# Altium schematic sheet 元器件模块原理图.SchDoc
size A4
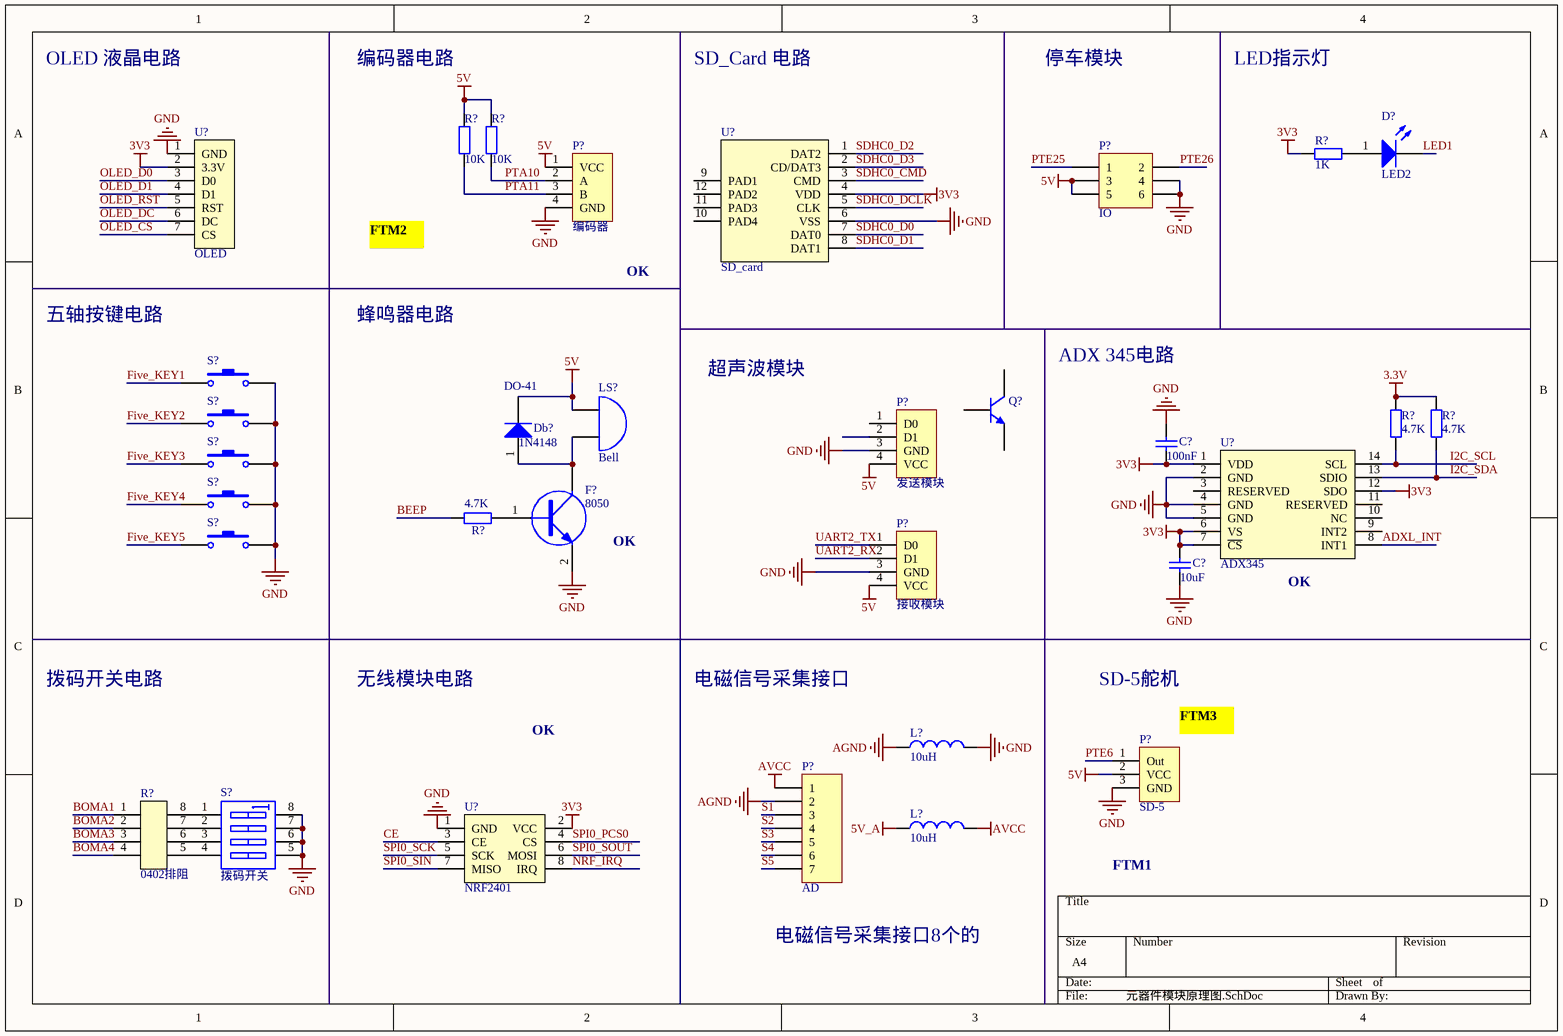
[diagram p0: 元器件模块原理图.SchDoc]

## Parts
(Parts that share a designator on the sheet are numbered #1, #2 ... from top to bottom, then left to right.)
C?#1  value 100nF  [C0603]  (hidden comment: Cap)
C?#2  value 10uF  [C0603]  (hidden comment: Cap)
D?  LED2  [LED-0805 - duplicate]
Db?  1N4148  PackageReference: DO-41  [二极管贴片]
F?  8050  [8050 贴片三极管]
L?#1  value 10uH  [R0603]  (hidden comment: Inductor)
L?#2  value 10uH  [R0603]  (hidden comment: Inductor)
LS?  Bell  [蜂鸣器]
P?#1  编码器  [HDR1X4]
P?#2  IO  [HDR2X3]
P?#3  发送模块  [HDR1X4]
P?#4  接收模块  [HDR1X4]
P?#5  SD-5  [HDR1X3]
P?#6  AD  [HDR1X7]
Q?  2N3904  [TO-92A]  (value not drawn)
R?#1  value 10K  [R0603]  (hidden comment: Res2)
R?#2  value 10K  [R0603]  (hidden comment: Res2)
R?#3  value 1K  [R0603]  (hidden comment: Res2)
R?#4  4.7K  [R0603]
R?#5  4.7K  [R0603]
R?#6  4.7K  [R0603]
R?#7  0402排阻  [0402_2]
S?#1  SW-PB  [KEY]  (value not drawn)
S?#2  SW-PB  [KEY]  (value not drawn)
S?#3  SW-PB  [KEY]  (value not drawn)
S?#4  SW-PB  [KEY]  (value not drawn)
S?#5  SW-PB  [KEY]  (value not drawn)
S?#6  拨码开关  [拨码开关]
U?#1  OLED  [HDR1X7]
U?#2  SD_card  [SD_Card]
U?#3  ADX345
U?#4  NRF2401  [HDR2X4]

## Nets
3.3V: R?#4.2 R?#5.2
3V3: C?#1.2 C?#2.1 R?#3.2 U?#1.2(3.3V) U?#2.4(VDD) U?#3.1(VDD) U?#3.6(VS) U?#3.7(~{CS}) U?#3.12(SDO) U?#4.2(VCC)
5V: Db?.2(K) LS?.1(A) P?#1.1(VCC) P?#2.3 P?#2.5 P?#3.4(VCC) P?#4.4(VCC) P?#5.2(VCC) R?#1.2 R?#2.2
5V_A: L?#2.1
AGND: L?#1.1 P?#6.2
AVCC: L?#2.2 P?#6.1
GND: C?#1.1 C?#2.2 F?.2(E) L?#1.2 P?#1.4(GND) P?#2.4 P?#2.6 P?#3.3(GND) P?#4.3(GND) P?#5.3(GND) S?#1.2 S?#2.2 S?#3.2 S?#4.2 S?#5.2 S?#6.5(B4) S?#6.6(B3) S?#6.7(B2) S?#6.8(B1) U?#1.1(GND) U?#2.6(VSS) U?#3.2(GND) U?#3.4(GND) U?#3.5(GND) U?#4.1(GND)
ADXL_INT: U?#3.8(INT1)
BEEP: R?#6.1
BOMA1: R?#7.1
BOMA2: R?#7.2
BOMA3: R?#7.3
BOMA4: R?#7.4
CE: U?#4.3(CE)
Five_KEY1: S?#1.1
Five_KEY2: S?#2.1
Five_KEY3: S?#3.1
Five_KEY4: S?#4.1
Five_KEY5: S?#5.1
I2C_SCL: R?#4.1 U?#3.14(SCL)
I2C_SDA: R?#5.1 U?#3.13(SDIO)
LED1: D?.2(K)
NRF_IRQ: U?#4.8(IRQ)
OLED_CS: U?#1.7(CS)
OLED_D0: U?#1.3(D0)
OLED_D1: U?#1.4(D1)
OLED_DC: U?#1.6(DC)
OLED_RST: U?#1.5(RST)
PTA10: P?#1.2(A) R?#2.1
PTA11: P?#1.3(B) R?#1.1
PTE6: P?#5.1(Out)
PTE25: P?#2.1
PTE26: P?#2.2
S1: P?#6.3
S2: P?#6.4
S3: P?#6.5
S4: P?#6.6
S5: P?#6.7
SDHC0_CMD: U?#2.3(CMD)
SDHC0_D0: U?#2.7(DAT0)
SDHC0_D1: U?#2.8(DAT1)
SDHC0_D2: U?#2.1(DAT2)
SDHC0_D3: U?#2.2(CD/DAT3)
SDHC0_DCLK: U?#2.5(CLK)
SPI0_PCS0: U?#4.4(CS)
SPI0_SCK: U?#4.5(SCK)
SPI0_SIN: U?#4.7(MISO)
SPI0_SOUT: U?#4.6(MOSI)
UART2_RX: P?#4.2(D1)
UART2_TX: P?#4.1(D0)
NetD?_1: D?.1(A) R?#3.1
NetDb?_1: Db?.1(A) F?.3(C) LS?.2(B)
NetF?_1: F?.1(B) R?#6.2
NetR?#7_5: R?#7.5 S?#6.4(A4)
NetR?#7_6: R?#7.6 S?#6.3(A3)
NetR?#7_7: R?#7.7 S?#6.2(A2)
NetR?#7_8: R?#7.8 S?#6.1(A1)

Not connected (* = marked no-connect by the designer): P?#3 1(D0) 2(D1); Q? 1(E) 2(B) 3(C); U?#2 9(PAD1) 10(PAD4) 11(PAD3) 12(PAD2); U?#3 3(RESERVED) 9(INT2) 10(NC) 11(RESERVED)

## Notes on the sheet
- OLED 液晶电路
- 编码器电路
- SD_Card 电路
- 停车模块
- LED指示灯
- FTM2
- 五轴按键电路
- 蜂鸣器电路
- OK
- 超声波模块
- ADX 345电路
- (near F?) OK
- (near U?#3) OK
- 拨码开关电路
- 无线模块电路
- 电磁信号采集接口
- SD-5舵机
- (near P?#5) FTM3
- FTM1
- 电磁信号采集接口8个的

## Library data of the parts
C?#1 C?#2 = Cap: Capacitor; Published: 8-Jun-2000; LatestRevisionDate: 17-Jul-2002; LatestRevisionNote: Re-released for DXP Platform.; PackageReference: RAD-0.3; Publisher: Altium Limited
D? = LED2: Typical RED, GREEN, YELLOW, AMBER GaAs LED; Published: 8-Jun-2000; LatestRevisionDate: 17-Jul-2002; LatestRevisionNote: Re-released for DXP Platform.; PackageDocument: Feb-2002; PackageReference: 3.2X1.6X1.1; Publisher: Altium Limited
Db? = Diode 1N4001: 1 Amp General Purpose Rectifier; Published: 8-Jun-2000; LatestRevisionDate: 17-Jul-2002; LatestRevisionNote: Re-released for DXP Platform.; DatasheetVersion: 1998; PackageVersion: Aug-1999; Publisher: Altium Limited; PackageDescription: Diode, Axial; Body 5.2 x 2.7 mm (LxDia. max), Lead Dia. 0.86 mm (max); Code_JEDEC: DO-204-AL; ComponentLink1Description: Manufacturer Link; ComponentLink1URL: http://www.fairchildsemi.com/; ComponentLink2Description: Datasheet; ComponentLink2URL: http://www.fairchildsemi.com/ds/1N%2F1N4001.pdf
F? = NPN: NPN Transistor
L?#1 L?#2 = Inductor: Code_IEC: 1005; Published: 8-Jun-2000; LatestRevisionDate: 17-Jul-2002; LatestRevisionNote: Re-released for DXP Platform.; PackageReference: 0402-A; Publisher: Altium Limited; Code_JEITA: 0402
LS? = Bell: Electrical Bell; Published: 24-Mar-1999; LatestRevisionDate: 17-Jul-2002; LatestRevisionNote: Re-released for DXP Platform.; PackageReference: PIN2; Publisher: Altium Limited
P?#1 P?#3 P?#4 = Header 4: Header, 4-Pin; LatestRevisionDate: 17-Jul-2002; LatestRevisionNote: Re-released for DXP Platform.; Publisher: Altium Limited
P?#2 = Header 3X2: Header, 3-Pin, Dual row; LatestRevisionDate: 17-Jul-2002; LatestRevisionNote: Re-released for DXP Platform.; Publisher: Altium Limited
P?#5 = Header 3: Header, 3-Pin; LatestRevisionDate: 17-Jul-2002; LatestRevisionNote: Re-released for DXP Platform.; Publisher: Altium Limited
P?#6 = Header 7: Header, 7-Pin; LatestRevisionDate: 17-Jul-2002; LatestRevisionNote: Re-released for DXP Platform.; Publisher: Altium Limited
Q? = 2N3904: NPN General Purpose Amplifier; Published: 8-Jun-2000; LatestRevisionDate: 15-Jan-2003; LatestRevisionNote: PCB Footprint 'BCY-W3/D4.7' replaced; DatasheetVersion: 1997; PackageVersion: Sep-1998; PackageReference: TO-92A; Publisher: Altium Limited; PackageDescription: TO, Flat Index; 3 In-Line, Axial Leads; Body Dia. 4.5mm; Leads 0.51 x 0.48 mm (max); ComponentLink1Description: Manufacturer Link; ComponentLink1URL: http://www.fairchildsemi.com/; ComponentLink2Description: Datasheet; ComponentLink2URL: http://www.fairchildsemi.com/ds/2N%2F2N3904.pdf
R?#1-R?#6 = Res2: Resistor; Published: 8-Jun-2000; LatestRevisionDate: 17-Jul-2002; LatestRevisionNote: Re-released for DXP Platform.; PackageReference: AXIAL-0.4; Publisher: Altium Limited
  R?#4-R?#6: PackageDescription: Axial Device, Thru-Hole; 2 Leads; 0.4 in Pin Spacing; Value: 4.7K
S?#1-S?#5 = SW-PB: Switch; Published: 24-Mar-1999; LatestRevisionDate: 17-Jul-2002; LatestRevisionNote: Re-released for DXP Platform.; PackageReference: SPST-2; Publisher: Altium Limited
S?#6 = SW DIP-4: DIP Switch, 4 Position, SPST; Published: 24-Mar-1999; LatestRevisionDate: 17-Jul-2002; LatestRevisionNote: Re-released for DXP Platform.; PackageReference: SO8; Publisher: Altium Limited; Code_JEDEC: MS-012-AA; Code_IPC: SO8